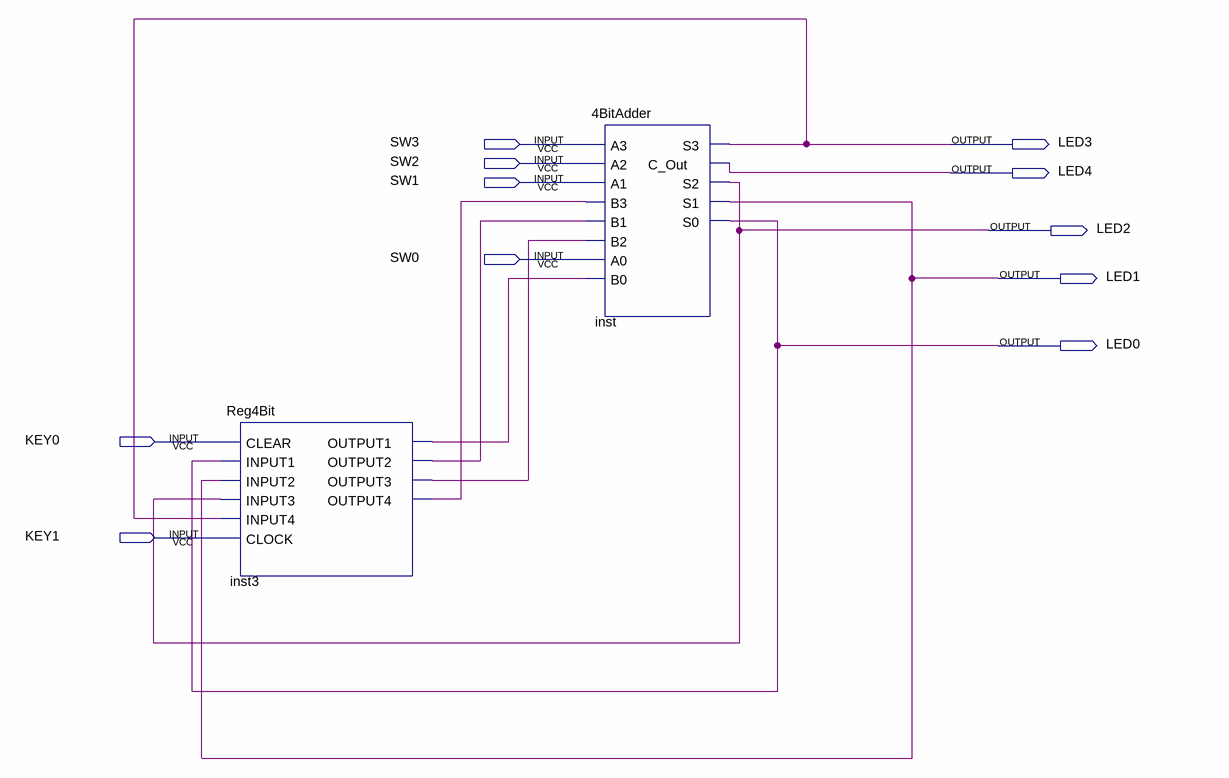
[diagram p0: schematic sheet]
// Quartus schematic Accum4Bit.bdf as structural Verilog: 2 symbols, 11 pins
module Accum4Bit (
  input  SW3,
  input  SW2,
  input  SW1,
  input  SW0,
  input  KEY0,
  input  KEY1,
  output LED3,
  output LED4,
  output LED2,
  output LED1,
  output LED0
);

  wire inst3_output1, inst3_output2, inst3_output3, inst3_output4;

  Reg4Bit inst3 (
    .CLEAR(KEY0), .INPUT1(LED0), .INPUT2(LED1), .INPUT3(LED2), .INPUT4(LED3), .CLOCK(KEY1),
    .OUTPUT1(inst3_output1), .OUTPUT2(inst3_output2), .OUTPUT3(inst3_output3), .OUTPUT4(inst3_output4));
  \4BitAdder  inst (
    .A3(SW3), .A2(SW2), .A1(SW1), .B3(inst3_output4), .B1(inst3_output2), .B2(inst3_output3), .A0(SW0),
    .B0(inst3_output1), .S3(LED3), .C_Out(LED4), .S2(LED2), .S1(LED1), .S0(LED0));
endmodule
